# Altium schematic sheet Microcontroller.SchDoc
size A4; SheetNumber: 4; SheetTotal: 6
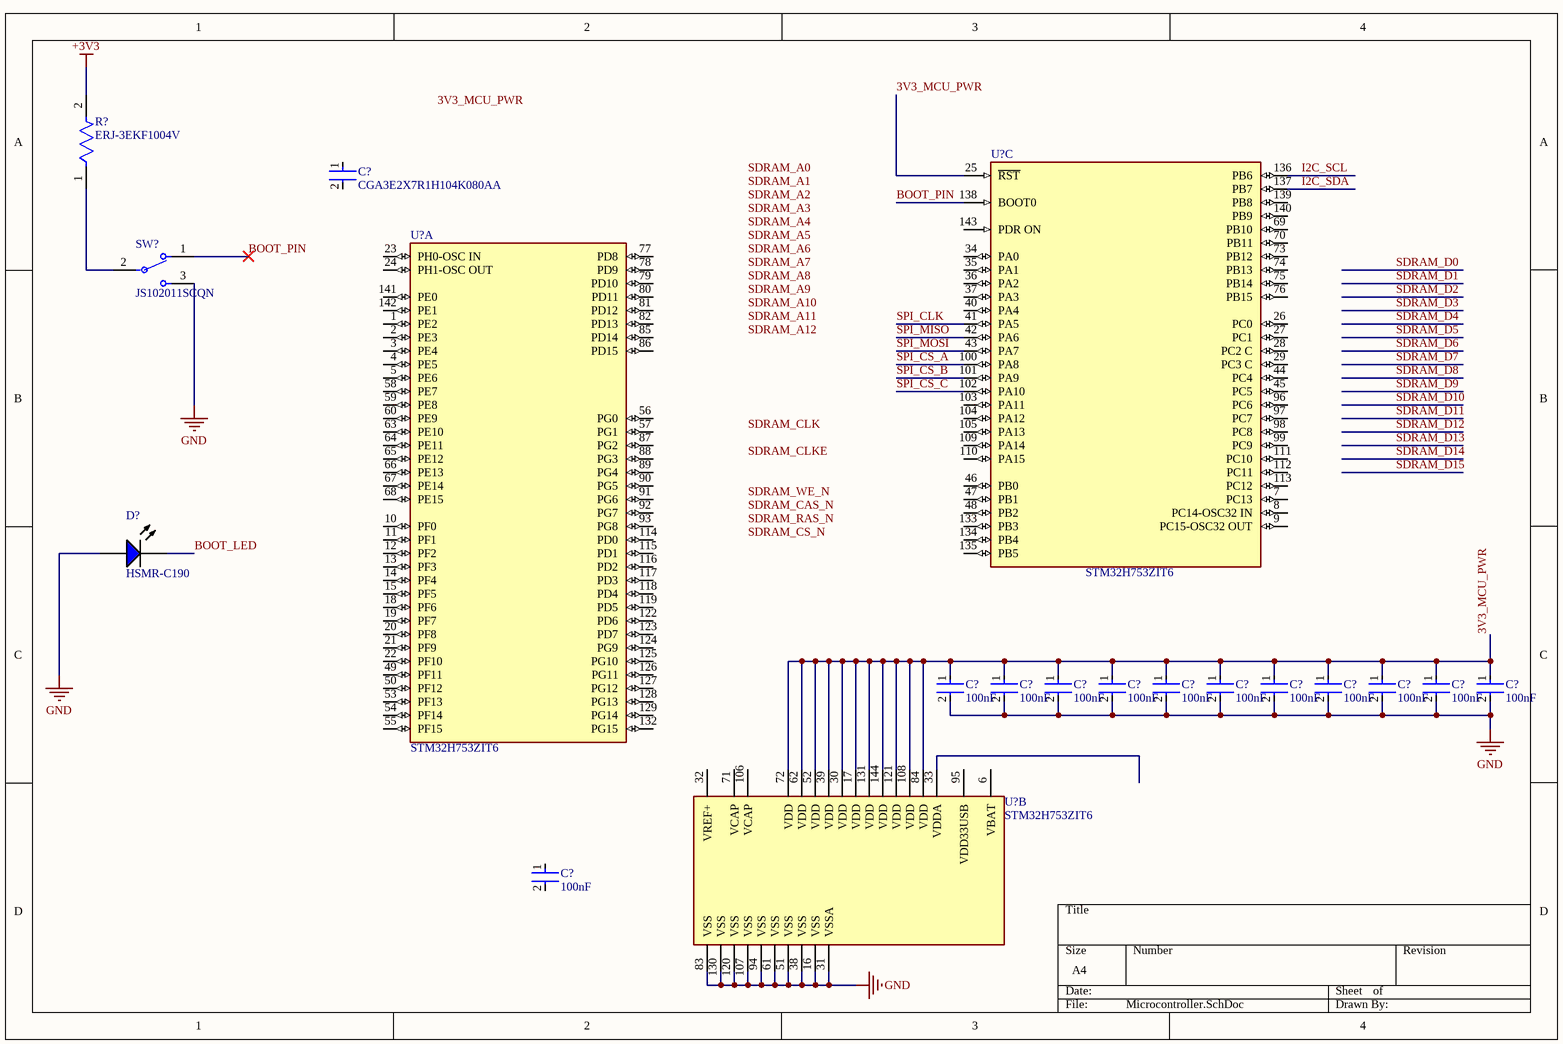
[diagram p0: Microcontroller.SchDoc]

## Parts
(Parts that share a designator on the sheet are numbered #1, #2 ... from top to bottom, then left to right.)
C?#1  CGA3E2X7R1H104K080AA  [FP-CGA3E-0_3-0_1-IPC_A]
C?#2  100nF  [FP-CGA3E-0_3-0_1-IPC_A]
C?#3  100nF  [FP-CGA3E-0_3-0_1-IPC_A]
C?#4  100nF  [FP-CGA3E-0_3-0_1-IPC_A]
C?#5  100nF  [FP-CGA3E-0_3-0_1-IPC_A]
C?#6  100nF  [FP-CGA3E-0_3-0_1-IPC_A]
C?#7  100nF  [FP-CGA3E-0_3-0_1-IPC_A]
C?#8  100nF  [FP-CGA3E-0_3-0_1-IPC_A]
C?#9  100nF  [FP-CGA3E-0_3-0_1-IPC_A]
C?#10  100nF  [FP-CGA3E-0_3-0_1-IPC_A]
C?#11  100nF  [FP-CGA3E-0_3-0_1-IPC_A]
C?#12  100nF  [FP-CGA3E-0_3-0_1-IPC_A]
C?#13  100nF  [FP-CGA3E-0_3-0_1-IPC_A]
D?  HSMR-C190  [AVAG-HSMX-C190_V]
R?  ERJ-3EKF1004V  [FP-ERJ3EK-IPC_C]
SW?  JS102011SCQN  [FP-JS102011SCQN-MFG]
U?#1  STM32H753ZIT6  [FP-LQFP144-1A-MFG]  (part C of 3)
U?#2  STM32H753ZIT6  [FP-LQFP144-1A-MFG]  (part A of 3)
U?#3  STM32H753ZIT6  [FP-LQFP144-1A-MFG]  (part B of 3)

## Nets
+3V3: R?.2
GND: C?#2.2 C?#3.2 C?#4.2 C?#5.2 C?#6.2 C?#7.2 C?#8.2 C?#9.2 C?#10.2 C?#11.2 C?#12.2 D?.1(A) SW?.3 U?#3.16(VSS) U?#3.31(VSSA) U?#3.38(VSS) U?#3.51(VSS) U?#3.61(VSS) U?#3.83(VSS) U?#3.94(VSS) U?#3.107(VSS) U?#3.120(VSS) U?#3.130(VSS)
3V3_MCU_PWR: C?#2.1 C?#3.1 C?#4.1 C?#5.1 C?#6.1 C?#7.1 C?#8.1 C?#9.1 C?#10.1 C?#11.1 C?#12.1 U?#1.25(~{RST}) U?#3.17(VDD) U?#3.30(VDD) U?#3.39(VDD) U?#3.52(VDD) U?#3.62(VDD) U?#3.72(VDD) U?#3.84(VDD) U?#3.108(VDD) U?#3.121(VDD) U?#3.131(VDD) U?#3.144(VDD)
BOOT_LED: D?.2(K)
BOOT_PIN: SW?.1 U?#1.138(BOOT0)
I2C_SCL: U?#1.136(PB6)
I2C_SDA: U?#1.137(PB7)
SPI_CLK: U?#1.41(PA5)
SPI_CS_A: U?#1.100(PA8)
SPI_CS_B: U?#1.101(PA9)
SPI_CS_C: U?#1.102(PA10)
SPI_MISO: U?#1.42(PA6)
SPI_MOSI: U?#1.43(PA7)
NetR?_1: R?.1 SW?.2(C)

Not connected (* = marked no-connect by the designer): C?#1 1 2; C?#13 1 2; U?#1 7(PC13) 8(PC14-OSC32_IN) 9(PC15-OSC32_OUT) 26(PC0) 27(PC1) 28(PC2_C) 29(PC3_C) 34(PA0) 35(PA1) 36(PA2) 37(PA3) 40(PA4) 44(PC4) 45(PC5) 46(PB0) 47(PB1) 48(PB2) 69(PB10) 70(PB11) 73(PB12) 74(PB13) 75(PB14) 76(PB15) 96(PC6) 97(PC7) 98(PC8) 99(PC9) 103(PA11) 104(PA12) 105(PA13) 109(PA14) 110(PA15) 111(PC10) 112(PC11) 113(PC12) 133(PB3) 134(PB4) 135(PB5) 139(PB8) 140(PB9) 143(PDR_ON); U?#2 1(PE2) 2(PE3) 3(PE4) 4(PE5) 5(PE6) 10(PF0) 11(PF1) 12(PF2) 13(PF3) 14(PF4) 15(PF5) 18(PF6) 19(PF7) 20(PF8) 21(PF9) 22(PF10) 23(PH0-OSC_IN) 24(PH1-OSC_OUT) 49(PF11) 50(PF12) 53(PF13) 54(PF14) 55(PF15) 56(PG0) 57(PG1) 58(PE7) 59(PE8) 60(PE9) 63(PE10) 64(PE11) 65(PE12) 66(PE13) 67(PE14) 68(PE15) 77(PD8) 78(PD9) 79(PD10) 80(PD11) 81(PD12) 82(PD13) 85(PD14) 86(PD15) 87(PG2) 88(PG3) 89(PG4) 90(PG5) 91(PG6) 92(PG7) 93(PG8) 114(PD0) 115(PD1) 116(PD2) 117(PD3) 118(PD4) 119(PD5) 122(PD6) 123(PD7) 124(PG9) 125(PG10) 126(PG11) 127(PG12) 128(PG13) 129(PG14) 132(PG15) 141(PE0) 142(PE1); U?#3 6(VBAT) 32(VREF+) 33(VDDA) 71(VCAP) 95(VDD33USB) 106(VCAP)

## Notes on the sheet
- Labels drawn without touching a wire or pin: 3V3_MCU_PWR, SDRAM_A0, SDRAM_A1, SDRAM_A2, SDRAM_A3, SDRAM_A4, SDRAM_A5, SDRAM_A6, SDRAM_A7, SDRAM_A8, SDRAM_A9, SDRAM_A10, SDRAM_A11, SDRAM_A12, SDRAM_CAS_N, SDRAM_CLK, SDRAM_CLKE, SDRAM_CS_N, SDRAM_RAS_N, SDRAM_WE_N

## Library data of the parts
C?#1-C?#13 = CMP-2000-07546-2: Cap Ceramic 100nF 50V X7R 10% Pad SMD 0603 +125°C Automotive T/R; Weight: 7.1E-05oz; Composition: Ceramic; Max Operating Temperature: 125°C; Termination: SMD/SMT; Dielectric: X7R; Length: 1.6mm; Package Quantity: 1; REACH SVHC: No SVHC; Lead Free: Lead Free; Case Code (Metric): 1608; Min Operating Temperature: -55°C; Packaging: Tape and Reel; Tolerance: 10%; Voltage Rating: 50V; Case Code (Imperial): 0603; Capacitance: 100nF; Case/Package: 0603; Voltage Rating (DC): 50V; Depth: 0.8mm; Radiation Hardening: No; Ratings: AEC-Q200; Mount: Surface Mount; Voltage: 50V; Thickness: 0.035inch; Width: 0.8mm; Height: 0.8mm
D? = CMP-1744-00007-1: LED Uni-Color Blue, 78 mW, 20 mA, -40 to 85 degC, 2-Pin SMD, RoHS, Tape and Reel; Rds On Max: 10 Ohm; Nominal Vgs: -1.7 V; Max Power Dissipation: 360 mW; Elements: 1; Case\Package: TO-236-3; Input Capacitance: 73 pF; Typical Rise Time: 6.3 ns; Nominal Dual Supply Voltage: -50 V; Packaging: Tape and Reel; Height: 0.93 mm; Mount: Surface Mount; RoHSCompliant: true; DatasheetVersion: Apr-10; REACH SVHC: No SVHC; ComponentLink1URL: http://www.avagotech.com/; Radiation Hardening: No; ComponentLink3Description: Package Specification; ComponentLink3URL: http://www.fairchildsemi.com/dwg/MA/MA03D.pdf; ComponentLink2Description: Datasheet; PackageDescription: 2-Pin Surface Mount Device, Body 1.6 x 0.8 mm, Height 0.9 mm; Package Quantity: 3000; PackageReference: HSMX-C190; ComponentLink1Description: Manufacturer URL; Pins: 3; Length: 2.92 mm; ComponentLink2URL: http://docs.avagotech.com/docs/AV02-0977EN; Min Operating Temperature: -55 degC; Width: 1.3 mm; Max Operating Temperature: 150 degC
R? = CMP-1012-00849-3: RES SMD 1M OHM 1% 1/10W 0603; Resistance: 1MR; Voltage Rating: 75V; Temperature Coefficient: 100ppm/°C; Power Rating: 100mW; REACH SVHC: No SVHC; Radiation Hardening: No; Features: Automotive AEC-Q200; Case Code (Metric): 1608; Resistance Tolerance: 1%; Case/Package: 0603; Termination: SMD/SMT; Max Operating Temperature: 155°C; Tolerance: 1%; Size Code: 0603; Case Code (Imperial): 0603; Min Operating Temperature: -55°C; Number of Pins: 2; Mount: Surface Mount; Package Quantity: 1; Military Standard: Not; Voltage Rating (DC): 75V; Depth: 0.8mm; Packaging: Tape and Reel; Width: 0.8mm; Number of Terminations: 2; Length: 1.6mm; Height: 0.022inch; RoHS Compliant: Yes; Resistor Type: Thick Film; Contact Plating: Tin; Lead Free: Lead Free; Series: ERJ; Construction: Rectangular; Max Power Dissipation: 100mW
SW? = CMP-10038-000023-1: SWITCH SLIDE SPDT 300MA 6V; Electrical Life: 5000Cycles; Actuator Type: Standard; Contact Resistance: 70mR; Actuator Material: Nylon; Max Voltage Rating (DC): 30V; Actuator Length: 2mm; Switch Function: On-On; Actuator Color: Black; Radiation Hardening: No; Throw Configuration: SPDT; Depth: 7.5mm; Case/Package: SMD/SMT; Package Quantity: 4000; Min Operating Temperature: -40°C; Length: 8.5mm; Current Rating: 300mA; Mount: Surface Mount; Voltage Rating (DC): 6V; RoHS Compliant: Yes; Orientation: Straight; Housing Material: Nylon; Contact Plating: Silver; Max Operating Temperature: 85°C; Packaging: Tape and Reel; Switch Travel: 2mm; Max Current Rating: 300mA; Contact Material: Copper Alloy; Series: JS; Termination: Gull Wing
U?#1-U?#3 = CMP-12105-000009-1: LQFP 144 20X20X1.4 2; Manufacturer: STMicroelectronics; Number Of Pwm Channels: 24; Number Of I/Os: 114; Number Of Cores: 1; Min Supply Voltage: 1.62V; Interface: I2C,SPI,UART,USART,CAN,USB,LIN,IrDA,Ethernet,I2S,SMBus,Other; Standoff Height: 0.05mm; Number Of I2C Channels: 4; Max Junction Temp: +125°C; Memory Type: FLASH; Ram Size: 1MBytes; Number Of Spi Channels: 6; Core Architecture: ARM Cortex-M7; Number Of Uart Channels: 9; Memory Size: 2MBytes; Number Of Adc Channels: 36; Frequency: 480MHz; Data Bus Width: 32bits; Max Supply Voltage: 3.6V; Number Of Usb Channels: 2; Number Of A/D Converters: 3; Number Of Timers/Counters: 20; Temperature Range High: +125°C; Automotive: No; Mouser Description: MCU 32-Bit STM32 ARM Cortex M7 RISC 2MB Flash 1.8V/2.5V/3.3V 144-Pin LQFP Tray; Device Class L3: Microcontrollers; Height: 1.6mm; Octopart: https://octopart.com/stm32h753zit6-stmicroelectronics-87879771; Device Class L2: Embedded Processors and Controllers; Lead Free: Yes; Category: IC; ComponentLink2URL: https://www.st.com/resource/en/datasheet/stm32h753zi.pdf; Ambient Temperature Range High: +85°C; Number Of Ethernet Channels: 1; Device Class L1: Integrated Circuits (ICs); Ambient Temperature Range Low: -40°C; Package: LQFP144-1A; Temperature Range Low: -40°C; Digikey Description: LQFP 144 20X20X1.4 2; ComponentLink2Description: Datasheet; Temperature: -40°C to +125°C; Manufacturer Part Number: STM32H753ZIT6; RoHS: TRUE